# Altium project EVK-NORA-W40.PrjPcb (part 3 of 4)

## Sheet EVK-NORA-W4_SCHEM_0004_Debug_Memory.SchDoc
size A3; Date: 04/04/2024; CompanyName: U-blox; DrawnBy: ASOH; Engineer: ASOH; Organization: U-blox; SheetNumber: 5; SheetTotal: 6; SheetSize: B; SheetTitle: Interface MCU
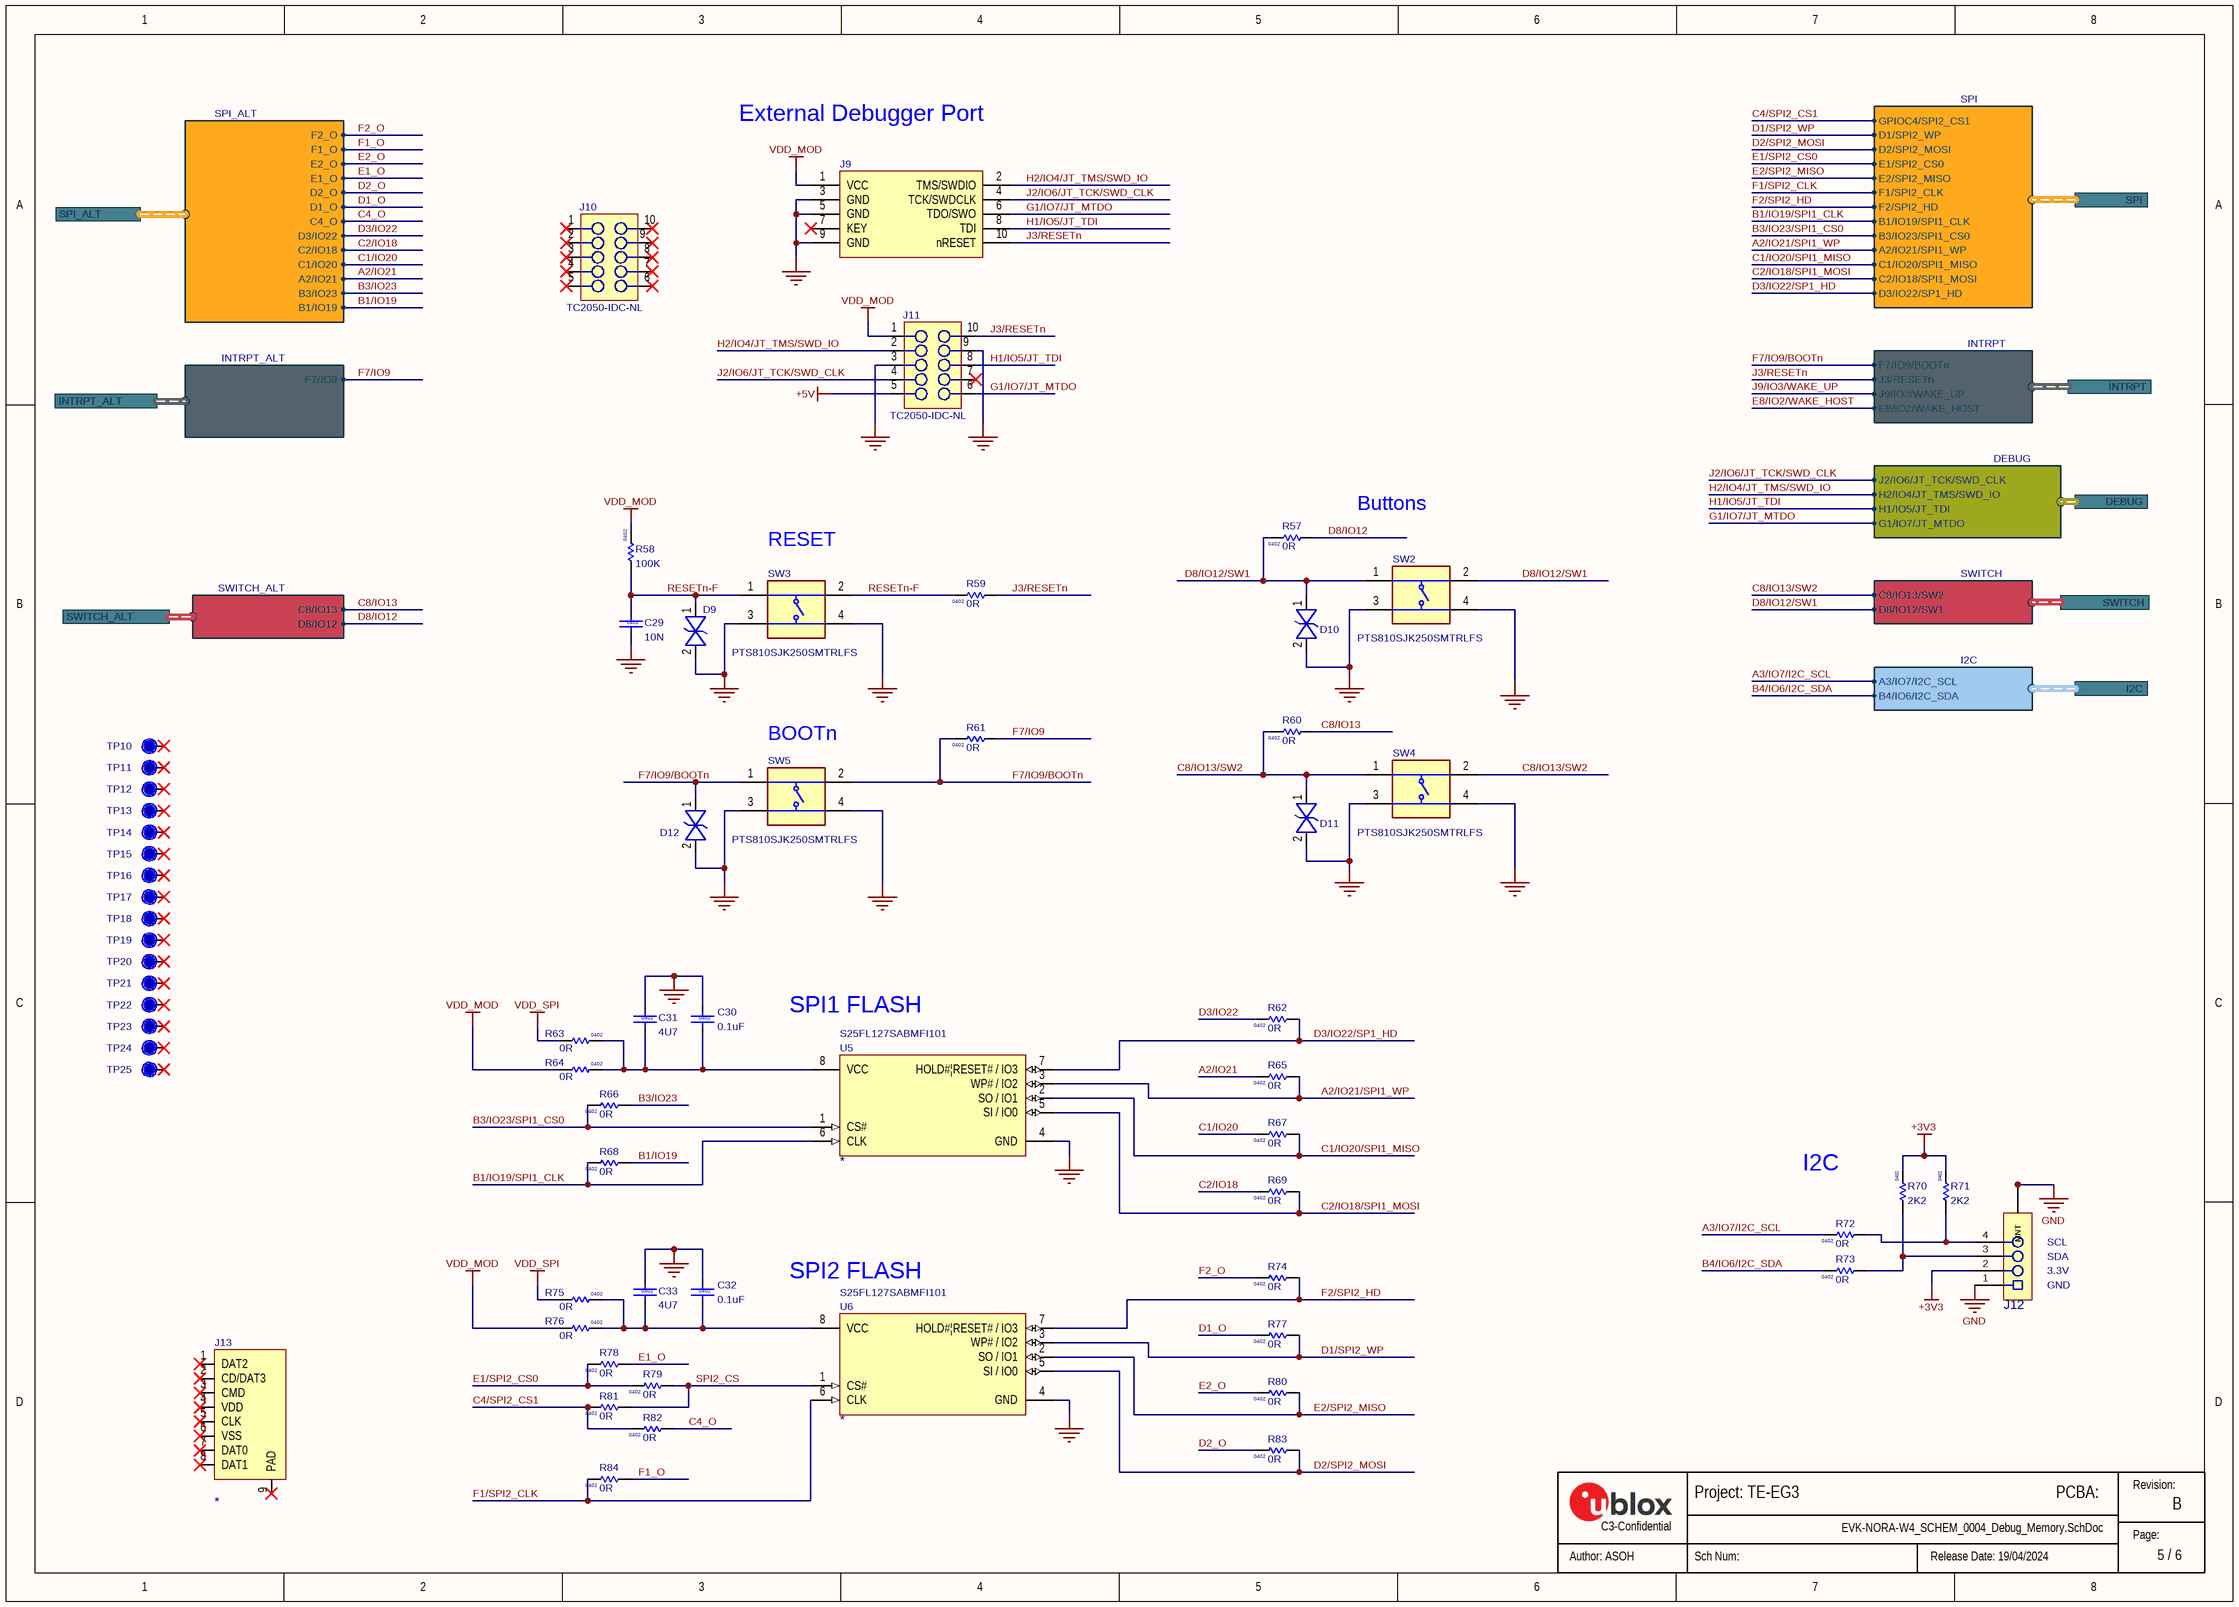
[diagram p4: EVK-NORA-W4_SCHEM_0004_Debug_Memory.SchDoc]

### Parts
C29  value 10N  Size: 0402  [Cap_0402_1100Lx600Wx600H_600x600Pad_350G_FLX]
C30  value 0.1uF  Size: 0402  [Cap 0402 HD]  (hidden comment: 120-000160.1uF)
C31  value 4U7  Size: 0402  [Cap 0402 HD]
C32  value 0.1uF  Size: 0402  [Cap 0402 HD]  (hidden comment: 120-000160.1uF)
C33  value 4U7  Size: 0402  [Cap 0402 HD]
D9  110-00019  [SOD-923]  (value not drawn)
D10  110-00019  [SOD-923]  (value not drawn)
D11  110-00019  [SOD-923]  (value not drawn)
D12  110-00019  [SOD-923]  (value not drawn)
J9  130-00099  [HDR.050P-10Pin-2x5-SMT_Key]  (value not drawn)
J10  TC2050-IDC-NLDNP  [TC2050-IDC-NL]  (value not drawn)  (no BOM)
J11  TC2050-IDC-NLDNP  [TC2050-IDC-NL]  (value not drawn)  (no BOM)
J12  UBXH04-0000797  [SM04B-SRSS-TB]  (value not drawn)
J13  (no value)  [Micro_SD_SKT_SMT_RA]
R57  value 0R  Size: 0402  [RES 0402 HD]
R58  value 100K  Size: 0402  [RES_0402_1100Lx600Wx400H_500x600Pad_400G_FLX]
R59  value 0R  Size: 0402  [RES 0402 HD]
R60  value 0R  Size: 0402  [RES 0402 HD]
R61  value 0R  Size: 0402  [RES 0402 HD]
R62  value 0R  Size: 0402  [RES 0402 HD]
R63  value 0R  Size: 0402  [RES 0402 HD]
R64  value 0R  Size: 0402  [RES 0402 HD]
R65  value 0R  Size: 0402  [RES 0402 HD]
R66  value 0R  Size: 0402  [RES 0402 HD]
R67  value 0R  Size: 0402  [RES 0402 HD]
R68  value 0R  Size: 0402  [RES 0402 HD]
R69  value 0R  Size: 0402  [RES 0402 HD]
R70  value 2K2  Size: 0402  [RES_0402_1100Lx600Wx400H_500x600Pad_400G_FLX]
R71  value 2K2  Size: 0402  [RES_0402_1100Lx600Wx400H_500x600Pad_400G_FLX]
R72  value 0R  Size: 0402  [RES 0402 HD]
R73  value 0R  Size: 0402  [RES 0402 HD]
R74  value 0R  Size: 0402  [RES 0402 HD]
R75  value 0R  Size: 0402  [RES 0402 HD]
R76  value 0R  Size: 0402  [RES 0402 HD]
R77  value 0R  Size: 0402  [RES 0402 HD]
R78  value 0R  Size: 0402  [RES 0402 HD]
R79  value 0R  Size: 0402  [RES 0402 HD]
R80  value 0R  Size: 0402  [RES 0402 HD]
R81  value 0R  Size: 0402  [RES 0402 HD]
R82  value 0R  Size: 0402  [RES 0402 HD]
R83  value 0R  Size: 0402  [RES 0402 HD]
R84  value 0R  Size: 0402  [RES 0402 HD]
SW2  PTS810SJK250SMTRLFS  [PTS810SJG250SMTRLFS]
SW3  PTS810SJK250SMTRLFS  [PTS810SJG250SMTRLFS]
SW4  PTS810SJK250SMTRLFS  [PTS810SJG250SMTRLFS]
SW5  PTS810SJK250SMTRLFS  [PTS810SJG250SMTRLFS]
TP10  TP  [TP10R]  (value not drawn)  (no BOM)
TP11  TP  [TP10R]  (value not drawn)  (no BOM)
TP12  TP  [TP10R]  (value not drawn)  (no BOM)
TP13  TP  [TP10R]  (value not drawn)  (no BOM)
TP14  TP  [TP10R]  (value not drawn)  (no BOM)
TP15  TP  [TP10R]  (value not drawn)  (no BOM)
TP16  TP  [TP10R]  (value not drawn)  (no BOM)
TP17  TP  [TP10R]  (value not drawn)  (no BOM)
TP18  TP  [TP10R]  (value not drawn)  (no BOM)
TP19  TP  [TP10R]  (value not drawn)  (no BOM)
TP20  TP  [TP10R]  (value not drawn)  (no BOM)
TP21  TP  [TP10R]  (value not drawn)  (no BOM)
TP22  TP  [TP10R]  (value not drawn)  (no BOM)
TP23  TP  [TP10R]  (value not drawn)  (no BOM)
TP24  TP  [TP10R]  (value not drawn)  (no BOM)
TP25  TP  [TP10R]  (value not drawn)  (no BOM)
U5  Manufacturer Part Number 1: S25FL127SABMFI101  [SOIC-8W]
U6  Manufacturer Part Number 1: S25FL127SABMFI101  [SOIC-8W]

### Ports
DEBUG (harness Debug), I2C (harness I2C), INTRPT (harness INTRPT), INTRPT_ALT (harness INTRPT_ALT), SPI (harness SPI), SPI_ALT (harness SPI_ALT), SWITCH (harness SWITCH), SWITCH_ALT (harness SWITCH_ALT)

### Harnesses
DEBUG: G1/IO7/JT_MTDO, H1/IO5/JT_TDI, H2/IO4/JT_TMS/SWD_IO, J2/IO6/JT_TCK/SWD_CLK
INTRPT: F7/IO9/BOOTn, J3/RESETn, J9/IO3/WAKE_UP, E8/IO2/WAKE_HOST
SPI_ALT: C4_O, D1_O, D2_O, E1_O, E2_O, F1_O, F2_O, D3/IO22, C2/IO18, C1/IO20, A2/IO21, B3/IO23, B1/IO19
SWITCH_ALT: C8/IO13, D8/IO12
INTRPT_ALT: F7/IO9
SPI: GPIOC4/SPI2_CS1, D1/SPI2_WP, D2/SPI2_MOSI, E1/SPI2_CS0, E2/SPI2_MISO, F1/SPI2_CLK, F2/SPI2_HD, B1/IO19/SPI1_CLK, B3/IO23/SPI1_CS0, A2/IO21/SPI1_WP, C1/IO20/SPI1_MISO, C2/IO18/SPI1_MOSI, D3/IO22/SP1_HD
SWITCH: C8/IO13/SW2, D8/IO12/SW1
I2C: A3/IO7/I2C_SCL, B4/IO6/I2C_SDA

### Nets
+3V3: J12.2 R70.2 R71.2
+5V: J11.5
GND: C29.2 C30.1 C31.1 C32.1 C33.1 D9.2 D10.2 D11.2 D12.2 J9.3(GND) J9.5(GND) J9.9(GND) J11.3 J12.1 J12.M1(MNT) J12.M2(MNT) SW2.3 SW2.4 SW3.3 SW3.4 SW4.3 SW4.4 SW5.3 SW5.4 U5.4(GND) U6.4(GND)
VDD_MOD: J9.1(VCC) J11.1 R58.2 R64.1 R76.1
VDD_SPI: R63.1 R75.1
A2/IO21: R65.2 ; port SPI_ALT.A2/IO21
A2/IO21/SPI1_WP: R65.1 U5.3(WP#_/_IO2) ; port SPI.A2/IO21/SPI1_WP
A3/IO7/I2C_SCL: R72.2 ; port I2C.A3/IO7/I2C_SCL
B1/IO19: R68.1 ; port SPI_ALT.B1/IO19
B1/IO19/SPI1_CLK: R68.2 U5.6(CLK) ; port SPI.B1/IO19/SPI1_CLK
B3/IO23: R66.1 ; port SPI_ALT.B3/IO23
B3/IO23/SPI1_CS0: R66.2 U5.1(CS#) ; port SPI.B3/IO23/SPI1_CS0
B4/IO6/I2C_SDA: R73.2 ; port I2C.B4/IO6/I2C_SDA
C1/IO20: R67.2 ; port SPI_ALT.C1/IO20
C1/IO20/SPI1_MISO: R67.1 U5.2(SO_/_IO1) ; port SPI.C1/IO20/SPI1_MISO
C2/IO18: R69.2 ; port SPI_ALT.C2/IO18
C2/IO18/SPI1_MOSI: R69.1 U5.5(SI_/_IO0) ; port SPI.C2/IO18/SPI1_MOSI
C4/SPI2_CS1: R81.2 R82.2 ; port SPI.GPIOC4/SPI2_CS1
C4_O: R82.1 ; port SPI_ALT.C4_O
C8/IO13: R60.1 ; port SWITCH_ALT.C8/IO13
C8/IO13/SW2: D11.1 R60.2 SW4.1 SW4.2 ; port SWITCH.C8/IO13/SW2
D1/SPI2_WP: R77.1 U6.3(WP#_/_IO2) ; port SPI.D1/SPI2_WP
D1_O: R77.2 ; port SPI_ALT.D1_O
D2/SPI2_MOSI: R83.1 U6.5(SI_/_IO0) ; port SPI.D2/SPI2_MOSI
D2_O: R83.2 ; port SPI_ALT.D2_O
D3/IO22: R62.2 ; port SPI_ALT.D3/IO22
D3/IO22/SP1_HD: R62.1 U5.7(HOLD#|RESET#_/_IO3) ; port SPI.D3/IO22/SP1_HD
D8/IO12: R57.1 ; port SWITCH_ALT.D8/IO12
D8/IO12/SW1: D10.1 R57.2 SW2.1 SW2.2 ; port SWITCH.D8/IO12/SW1
E1/SPI2_CS0: R78.2 R79.2 ; port SPI.E1/SPI2_CS0
E1_O: R78.1 ; port SPI_ALT.E1_O
E2/SPI2_MISO: R80.1 U6.2(SO_/_IO1) ; port SPI.E2/SPI2_MISO
E2_O: R80.2 ; port SPI_ALT.E2_O
F1/SPI2_CLK: R84.2 U6.6(CLK) ; port SPI.F1/SPI2_CLK
F1_O: R84.1 ; port SPI_ALT.F1_O
F2/SPI2_HD: R74.1 U6.7(HOLD#|RESET#_/_IO3) ; port SPI.F2/SPI2_HD
F2_O: R74.2 ; port SPI_ALT.F2_O
F7/IO9: R61.1 ; port INTRPT_ALT.F7/IO9
F7/IO9/BOOTn: D12.1 R61.2 SW5.1 SW5.2 ; port INTRPT.F7/IO9/BOOTn
G1/IO7/JT_MTDO: J9.6(TDO/SWO) J11.6 ; port DEBUG.G1/IO7/JT_MTDO
H1/IO5/JT_TDI: J9.8(TDI) J11.8 ; port DEBUG.H1/IO5/JT_TDI
H2/IO4/JT_TMS/SWD_IO: J9.2(TMS/SWDIO) J11.2 ; port DEBUG.H2/IO4/JT_TMS/SWD_IO
J2/IO6/JT_TCK/SWD_CLK: J9.4(TCK/SWDCLK) J11.4 ; port DEBUG.J2/IO6/JT_TCK/SWD_CLK
J3/RESETn: J9.10(nRESET) J11.10 R59.1 ; port INTRPT.J3/RESETn
RESETn-F: C29.1 D9.1 R58.1 R59.2 SW3.1 SW3.2
SPI2_CS: R79.1 R81.1 U6.1(CS#)
NetC30_2: C30.2 C31.2 R63.2 R64.2 U5.8(VCC)
NetC32_2: C32.2 C33.2 R75.2 R76.2 U6.8(VCC)
NetJ12_3: J12.3 R70.1 R73.1
NetJ12_4: J12.4 R71.1 R72.1

Not connected (* = marked no-connect by the designer): J9 7(KEY)*; J10 1* 2* 3* 4* 5* 6* 7* 8* 9 10*; J11 7* 9; J13 1(DAT2)* 2(CD/DAT3)* 3(CMD)* 4(VDD)* 5(CLK)* 6(VSS)* 7(DAT0)* 8(DAT1)* 9(PAD)*; TP10 1*; TP11 1*; TP12 1*; TP13 1*; TP14 1*; TP15 1*; TP16 1*; TP17 1*; TP18 1*; TP19 1*; TP20 1*; TP21 1*; TP22 1*; TP23 1*; TP24 1*; TP25 1*

### Notes on the sheet
- External Debugger Port
- (near SW3) RESET
- Buttons
- (near SW5) BOOTn
- (near U5) SPI1 FLASH
- I2C
- (near J12) SCL
- (near J12) SDA
- (near U6) SPI2 FLASH
- (near J12) GND
- (near J12) 3.3V
- Revision:
- C3-Confidential
- Page:

### Library data of the parts
C29 = UBXH01-0023025: CAP CER X7R 0402 10N 10% 16V; Manufacturer: Murata Manufacturing Company, Ltd.; Manufacturer P/N: GRM155R71C103KA01; Editor: roland.rust; Released by: anthony.gergis; Env: ROHS; Permitted Use: Volume Products; Perferred: PREF; Mfg P/N Status: NRND; Mfg P/N Split: 100; Mfg P/N Released: Yes; Part Number: UBXH01-0023025; Tolerance: 10%; Max Voltage: 16V; Min Operating Temp: -55°C; Max Operating Temp: 125°C; Part Type: Capacitor; Release Data: 2021-02-16T13:14:11; UBX Wiki: https://wiki.u-blox.com/bin/view/Operations/PartDetails?index=5491; RefDes: C; Manufacturer 2: Samsung Electro-Mechanics; Manufacturer P/N 2: CL05B103KO5NNNC; Mfg P/N Status 2: Active; Mfg P/N Split 2: 0; Mfg P/N Released 2: Yes; Mfg P/N Datasheet 2: https://wiki.u-blox.com/bin/view/Generic/Docs/DocumentSummary?index=28567
C30 C32 = 120-00016: Cap, Ceramic 0.1uF 10V 10% X5R 0402; Part Name: CAP CER 0.1UF 10V 10% X5R 0402; Part_Type: Ceramic Capacitor; Manufacturer: Murata Electronics North America; Manufacturer P/N: GRM155R61A104KA01J; Item_Phase: Production; Component Mounting Type: SMT; Tolerance: +/- 10%; Use in new designs: Yes; Part Number: 120-00016; Revision: 0A; Supplier 1: Digi-Key; Supplier Part Number 1: 490-6297-1-ND; Manufacturer 2: Yageo; Manufacturer P/N 2: CC0402KRX5R6BB104; Supplier 2: Digi-Key; Supplier Part Number 2: 311-1336-1-ND; Arena Link: https://app.bom.com/a/GYHPV2L2L43KRMBK?v=spec.summary; Height: 0.55mm; Pins: 2; Temperature Coefficient: X5R; Voltage: 10V
C31 C33 = UBXH01-0000243: CAP CER X5R 0402 4U7 20% 10V; Manufacturer: Murata Manufacturing Company, Ltd.; Manufacturer P/N: GRM155R61A475MEAA; Editor: martin.pilik; Released by: fabrice.bret-dibat; Env: GREEN; Permitted Use: Volume Products; Perferred: PREF; Mfg P/N Status: Active; Mfg P/N Split: 100; Mfg P/N Released: Yes; Part Number: UBXH01-0000243; Tolerance: 20%; Max Voltage: 10V; Min Operating Temp: -40°C; Max Operating Temp: 85°C; Part Type: Capacitor; Release Data: 2021-05-10 12:57:47.325652; UBX Wiki: https://wiki.u-blox.com/bin/view/Operations/PartDetails?index=24303; RefDes: C; Mfg P/N Datasheet: https://wiki.u-blox.com/bin/view/Generic/Docs/DocumentSummary?index=24302
D9-D12 = 110-00019: ESD9B3.3ST5G; Part Name: Diode TVS 3.3V SOD-923; Part_Type: Diode; Manufacturer: ON Semiconductor; Item_Phase: Preliminary; Body Size: 0.8mm x 0.6mm; Component Mounting Type: SMT; Diode Type: TVS; Use in new designs: Yes; Voltage: 3.3V; Part Number: 110-00019; Manufacturer P/N: ESD9B3.3ST5G; Supplier 1: Digi-Key; Supplier Part Number 1: ESD9B3.3ST5GOSCT-ND; Arena Link: https://app.bom.com/a/4M5DJQ9Q9SR7DV4H?v=spec.summary; Height: 0.4mm; MFG Package: SOD-923; Package Type: SOD; Pins: 2
J9 = 130-00099: Header 0.05" 10Pin 2Row SMD Black; Part Name: CON HDR 0.05" 10Pin 2Row SMD Black; Part_Type: Connector; Manufacturer: Samtec; Manufacturer P/N: FTSH-105-01-F-DV-K; Item_Phase: Pre-Production; Component Mounting Type: SMT; Keyed: Yes; Locking: No; Pin Pitch: 0.050"; Rows: 2; Part Number: 130-00099; Revision: 1; Supplier 1: Digi-Key; Supplier Part Number 1: SAM8796-ND; Arena Link: https://app.bom.com/a/5N6EKRARATS7TSHL?v=spec.summary; Color: Black; Connector Type: Header; Height: 6mm; Length: 12.75mm; Pins: 10; Use in new designs: Yes; Width: 4.78
J10 J11 = TC2050-IDC-NL: CON PADS FOR CBL PLUG-OF-NAILS 10-PIN NO LEGS; Manufacturer: TAG Connect; Added By: Paul B; Manufacturer P/N: TC2050-IDC-NL; Part Number: TC2050-IDC-NL; Size: 6.1mm x 9.9mm; Height: 0; DNP: DNP; Added Date: 12/3/2015
J12 = UBXH04-0000797: CONN JST SH SERIES SMT 4 POS MALE 1MM RA 50V 1A; Manufacturer 1: JST Sales America Inc.; Manufacturer Part Number 1: SM04B-SRSS-TB(LF)(SN); Part Name: CONN HEADER SMD R/A 4POS 1MM; Item Phase: In Production; Use in new designs: Yes; Voltage: None; Value: SM04B-SRSS-TB; Editor: eric.moog; Env: ROHS; Permitted Use: Support Products; Perferred: PREF; Mfg P/N Status: Active; Mfg P/N Split: 100; Mfg P/N Released: No; Part Number: UBXH04-0000797; Supplier 1: None; Supplier Part Number 1: None; Diameter: None; Height: 2.9mm; Max Operating Temp: 85°C; Min Operating Temp: -30°C; Pins: 4; Revision: 0A; UBX Code: None; Manufacturer 2: None; Manufacturer Part Number 2: None; Supplier 2: None; Supplier Part Number 2: None; Manufacturer P/N: SM04B-SRSS-TB; Max Voltage: 50V; Max Current: 1A; Part Type: Connector; UBX Wiki: https://wiki.u-blox.com/bin/view/Operations/PartDetails?index=38779; RefDes: J; Manufacturer: JST; Mfg P/N Datasheet: https://wiki.u-blox.com/bin/view/Generic/Docs/DocumentSummary?index=4533
J13 = 130-00062: Micro SD Card Socket, Right Angle, with 4 Ground Pads, SMT; Manufacturer 1: Molex Inc; Manufacturer Part Number 1: 0472192001; Part Name: CON Micro SD 1.1mm 8Pin 1Row SMT RA; Item Phase: In Production; Use in new designs: Yes; Voltage: None; Manufacturer P/N: *; Part Number: 130-00062; Supplier 1: Digi-Key; Supplier Part Number 1: WM6698CT-ND; Diameter: None; Height: 1.9mm; Max Operating Temp: None; Min Operating Temp: None; Pins: 8; Revision: 0A; UBX Code: None; Manufacturer 2: None; Manufacturer Part Number 2: None; Supplier 2: None; Supplier Part Number 2: None
R57 R59-R62 R65-R69 R72-R74 R77-R84 = UBXH18-0003002: RES THICK FILM CHIP 0402 0R 0 100mW; Manufacturer: KOA; Manufacturer P/N: RK73Z1ETTP; Tolerance: 0; Editor: charlotte.biber; Released by: peter.mueller; Env: ROHS; Permitted Use: Volume Products; Perferred: PREF; Mfg P/N Status: NRND; Mfg P/N Split: 100; Mfg P/N Released: Yes; Part Number: UBXH18-0003002; Max Power: 100mW; Part Type: Resistor; Release Data: 2012-06-05 09:49:55.978616; UBX Wiki: https://wiki.u-blox.com/bin/view/Operations/PartDetails?index=6611; RefDes: R; Manufacturer 2: YAGEO; Manufacturer P/N 2: 2322_705_91001_L; Mfg P/N Status 2: NRND; Mfg P/N Split 2: 0; Mfg P/N Released 2: Yes
R58 = UBXH18-0008097: RES THICK FILM CHIP 0402 100K 5% 100mW; Manufacturer: YAGEO; Manufacturer P/N: 2322_705_70104_L; Editor: roland.rust; Env: ROHS; Permitted Use: Volume Products; Perferred: PREF; Mfg P/N Status: Obsolete; Mfg P/N Split: 100; Mfg P/N Released: Yes; Part Number: UBXH18-0008097; Tolerance: 5%; Max Power: 100mW; Part Type: Resistor; Released by: roland.rust; Release Data: 2005-07-22T13:59:44; UBX Wiki: https://wiki.u-blox.com/bin/view/Operations/PartDetails?index=7020; RefDes: R; Manufacturer 2: KOA; Manufacturer P/N 2: RK73B1ETTD104J; Mfg P/N Status 2: NRND; Mfg P/N Split 2: 0; Mfg P/N Released 2: Yes
R63 R64 R75 R76 = UBXH18-0003002: RES THICK FILM CHIP 0402 0R 0 100mW; Manufacturer: KOA; Manufacturer P/N: RK73Z1ETTD; Tolerance: 0; Editor: charlotte.biber; Released by: peter.mueller; Env: ROHS; Permitted Use: Volume Products; Perferred: PREF; Mfg P/N Status: NRND; Mfg P/N Split: 100; Mfg P/N Released: Yes; Part Number: UBXH18-0003002; Max Power: 100mW; Part Type: Resistor; Release Data: 2012-06-05 09:49:55.978616; UBX Wiki: https://wiki.u-blox.com/bin/view/Operations/PartDetails?index=6611; RefDes: R; Manufacturer 2: YAGEO; Manufacturer P/N 2: 2322_705_91001_L; Mfg P/N Status 2: NRND; Mfg P/N Split 2: 0; Mfg P/N Released 2: Yes
R70 R71 = UBXH18-0008057: RES THICK FILM CHIP 0402 2K2 5% 100mW; Manufacturer: YAGEO; Manufacturer P/N: 2322_705_87222_L; Editor: roland.rust; Env: ROHS; Permitted Use: Volume Products; Perferred: PREF; Mfg P/N Status: Obsolete; Mfg P/N Split: 100; Mfg P/N Released: Yes; Part Number: UBXH18-0008057; Tolerance: 5%; Max Power: 100mW; Part Type: Resistor; Released by: roland.rust; Release Data: 2007-02-09T10:46:57; UBX Wiki: https://wiki.u-blox.com/bin/view/Operations/PartDetails?index=6956; RefDes: R; Manufacturer 2: YAGEO; Manufacturer P/N 2: RC0402JR-072K2L; Mfg P/N Status 2: Active; Mfg P/N Split 2: 0; Mfg P/N Released 2: Yes; Mfg P/N Datasheet 2: https://wiki.u-blox.com/bin/view/Generic/Docs/DocumentSummary?index=8163
SW2-SW5 = PTS810SJK250SMTRLFS: Switch; Manufacturer_Name: C & K COMPONENTS; Datasheet Link: https://www.ckswitches.com/media/1476/pts810.pdf; Manufacturer_Part_Number: PTS810SJK250SMTRLFS; Mouser Part Number: 611-PTS810SJK250SMTR; Mouser Price/Stock: https://www.mouser.co.uk/ProductDetail/CK/PTS810SJK250SMTRLFS?qs=UxeAxwACbqlfHzoZSrW3%2Fw%3D%3D
TP10-TP25 = TP10R: Testpoint, Round 1.0mm Dia; Added By: Jeremy D; Part Number: TP10R; Size: 1.0mm; Height: 0; DNP: DNP; Added Date: 2/1/2015; Checked By: Paul B; Checked Date: 2/5/2015
U5 U6 = 240-00017: IC, Flash 128MBIT, 108MHz, 8SOIC; Manufacturer 1: Cypress Semiconductor Corp; Part Name: IC Flash 128MBIT 108MHz 8SOIC; Body Size: 5.28mm x 5.28mm; Interface: SPI; Item Phase: Unreleased; Memory Type: Flash - NOR; MFG Package: 8-SOIC; SMT Pitch: 1.27mm; Thermal Pad: No; Use in new designs: Yes; Voltage: 3.6V; UBX Code: None; Manufacturer P/N: *; Part Number: 240-00017; Supplier 1: Digi-Key; Supplier Part Number 1: 1274-1045-ND; Height: 2.16mm; Memory Size: 128Mbit; Memory Speed: 108MHz; Max Operating Temp: 85; Min Operating Temp: -40; Pins: 8; Revision: None; Manufacturer 2: None; Manufacturer Part Number 2: None; Supplier 2: None; Supplier Part Number 2: None

## Sheet EVK-NORA-W4_SCHEM_0005_MikroE_ULED.SchDoc
size A3; Date: 04/04/2024; SheetNumber: 6; SheetTotal: 6
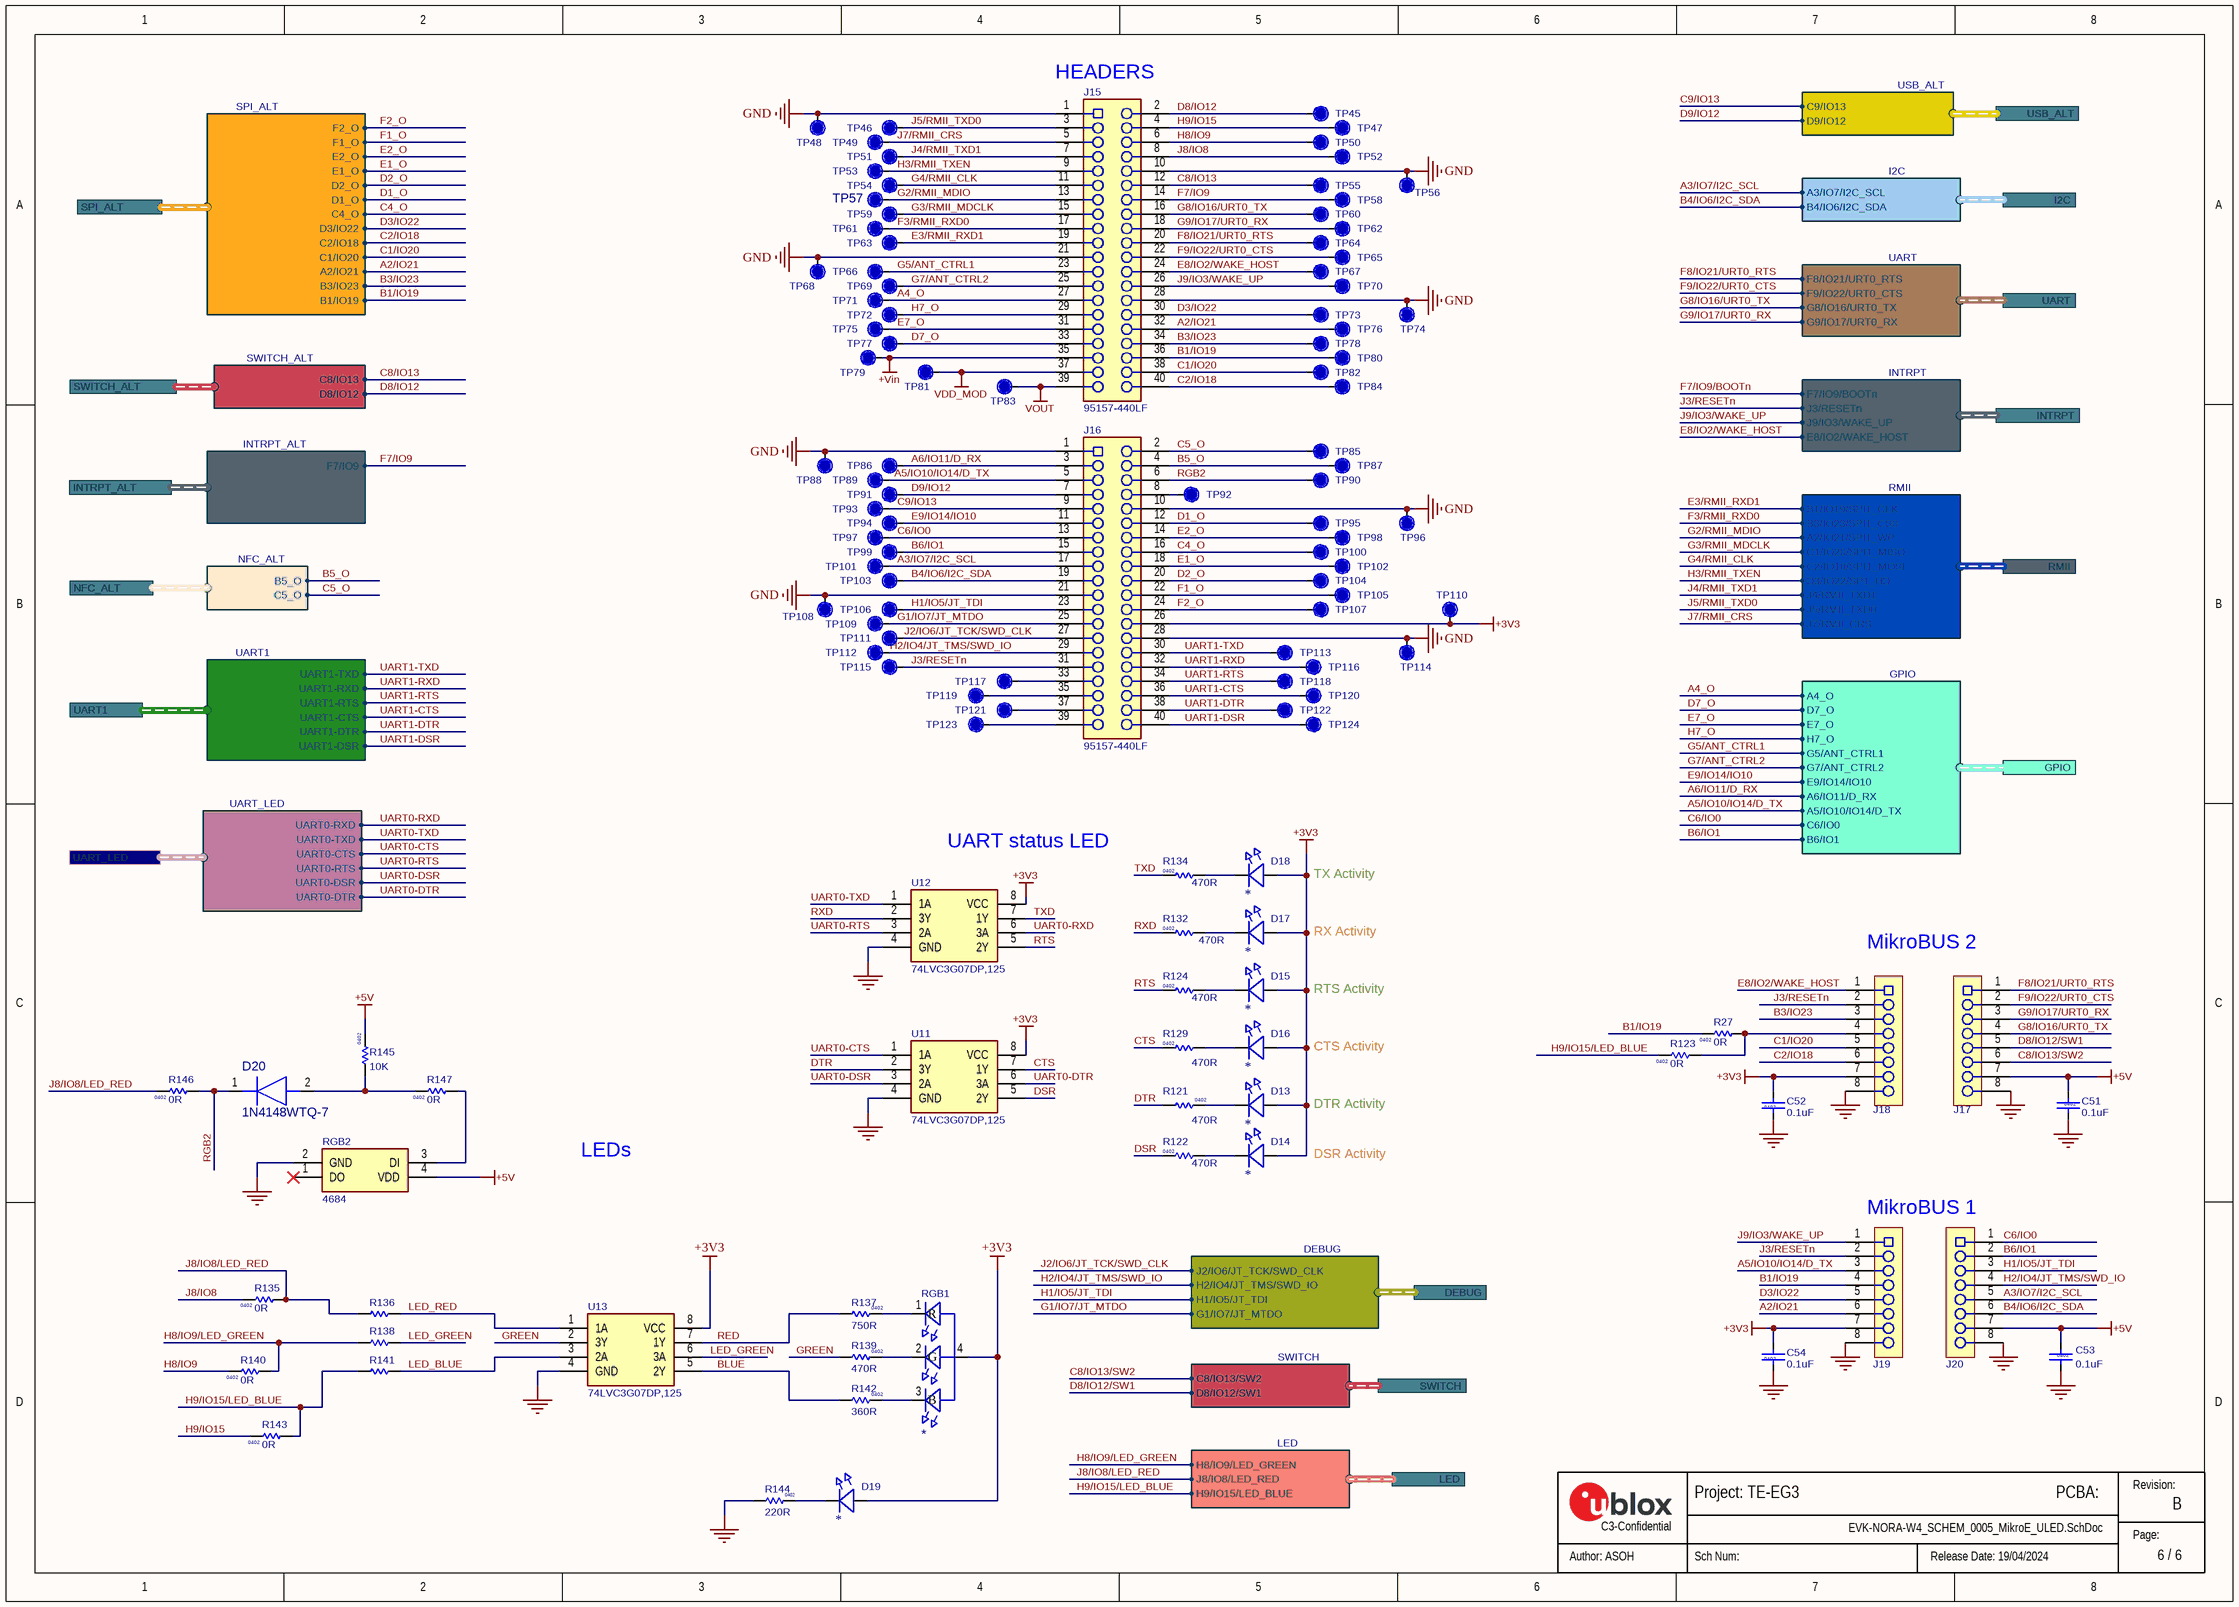
[diagram p5: EVK-NORA-W4_SCHEM_0005_MikroE_ULED.SchDoc]

### Parts
C51  value 0.1uF  Size: 0402  [Cap 0402 HD]  (hidden comment: 120-000160.1uF)
C52  value 0.1uF  Size: 0402  [Cap 0402 HD]  (hidden comment: 120-000160.1uF)
C53  value 0.1uF  Size: 0402  [Cap 0402 HD]  (hidden comment: 120-000160.1uF)
C54  value 0.1uF  Size: 0402  [Cap 0402 HD]  (hidden comment: 120-000160.1uF)
D13  (no value)  [LED_0603_GREEN]
D14  (no value)  [LED_0603_YELLOW]
D15  (no value)  [LED_0603_GREEN]
D16  (no value)  [LED_0603_YELLOW]
D17  (no value)  [LED_0603_YELLOW]
D18  (no value)  [LED_0603_GREEN]
D19  (no value)  [LED_0603_GREEN]
D20  1N4148WTQ-7  [SODFL1608X65N]
J15  95157-440LF  [M208762042]
J16  95157-440LF  [M208762042]
J17  (no value)  [SKT-0.1P-SSM-108-L-SV]
J18  (no value)  [SKT-0.1P-SSM-108-L-SV]
J19  (no value)  [SKT-0.1P-SSM-108-L-SV]
J20  (no value)  [SKT-0.1P-SSM-108-L-SV]
R27  value 0R  Size: 0402  [RES 0402 HD]
R121  value 470R  Size: 0402  [RES_0402_1100Lx600Wx400H_500x600Pad_400G_FLX]
R122  value 470R  Size: 0402  [RES_0402_1100Lx600Wx400H_500x600Pad_400G_FLX]
R123  value 0R  Size: 0402  [RES 0402 HD]
R124  value 470R  Size: 0402  [RES_0402_1100Lx600Wx400H_500x600Pad_400G_FLX]
R129  value 470R  Size: 0402  [RES_0402_1100Lx600Wx400H_500x600Pad_400G_FLX]
R132  value 470R  Size: 0402  [RES_0402_1100Lx600Wx400H_500x600Pad_400G_FLX]
R134  value 470R  Size: 0402  [RES_0402_1100Lx600Wx400H_500x600Pad_400G_FLX]
R135  value 0R  Size: 0402  [RES 0402 HD]
R136  (no value)  [RES 0402 HD]
R137  value 750R  Size: 0402  [RES_0402_1100Lx600Wx400H_500x600Pad_400G_FLX]
R138  (no value)  [RES 0402 HD]
R139  value 470R  Size: 0402  [RES_0402_1100Lx600Wx400H_500x600Pad_400G_FLX]
R140  value 0R  Size: 0402  [RES 0402 HD]
R141  (no value)  [RES 0402 HD]
R142  value 360R  Size: 0402  [RES_0402_1100Lx600Wx400H_500x600Pad_400G_FLX]
R143  value 0R  Size: 0402  [RES 0402 HD]
R144  value 220R  Size: 0402  [RES 0402 HD]
R145  value 10K  Size: 0402  [RES 0402 HD]
R146  value 0R  Size: 0402  [RES 0402 HD]
R147  value 0R  Size: 0402  [RES 0402 HD]
RGB1  (no value)  [LED_1616]
RGB2  4684  [4684]
TP45  TP  [TP10R]  (value not drawn)  (no BOM)
TP46  TP  [TP10R]  (value not drawn)  (no BOM)
TP47  TP  [TP10R]  (value not drawn)  (no BOM)
TP48  TP  [TP10R]  (value not drawn)  (no BOM)
TP49  TP  [TP10R]  (value not drawn)  (no BOM)
TP50  TP  [TP10R]  (value not drawn)  (no BOM)
TP51  TP  [TP10R]  (value not drawn)  (no BOM)
TP52  TP  [TP10R]  (value not drawn)  (no BOM)
TP53  TP  [TP10R]  (value not drawn)  (no BOM)
TP54  TP  [TP10R]  (value not drawn)  (no BOM)
TP55  TP  [TP10R]  (value not drawn)  (no BOM)
TP56  TP  [TP10R]  (value not drawn)  (no BOM)
TP57  TP  [TP10R]  (value not drawn)
TP58  TP  [TP10R]  (value not drawn)  (no BOM)
TP59  TP  [TP10R]  (value not drawn)  (no BOM)
TP60  TP  [TP10R]  (value not drawn)  (no BOM)
TP61  TP  [TP10R]  (value not drawn)  (no BOM)
TP62  TP  [TP10R]  (value not drawn)  (no BOM)
TP63  TP  [TP10R]  (value not drawn)  (no BOM)
TP64  TP  [TP10R]  (value not drawn)  (no BOM)
TP65  TP  [TP10R]  (value not drawn)  (no BOM)
TP66  TP  [TP10R]  (value not drawn)  (no BOM)
TP67  TP  [TP10R]  (value not drawn)  (no BOM)
TP68  TP  [TP10R]  (value not drawn)  (no BOM)
TP69  TP  [TP10R]  (value not drawn)  (no BOM)
TP70  TP  [TP10R]  (value not drawn)  (no BOM)
TP71  TP  [TP10R]  (value not drawn)  (no BOM)
TP72  TP  [TP10R]  (value not drawn)  (no BOM)
TP73  TP  [TP10R]  (value not drawn)  (no BOM)
TP74  TP  [TP10R]  (value not drawn)  (no BOM)
TP75  TP  [TP10R]  (value not drawn)  (no BOM)
TP76  TP  [TP10R]  (value not drawn)  (no BOM)
TP77  TP  [TP10R]  (value not drawn)  (no BOM)
TP78  TP  [TP10R]  (value not drawn)  (no BOM)
TP79  TP  [TP10R]  (value not drawn)  (no BOM)
TP80  TP  [TP10R]  (value not drawn)  (no BOM)
TP81  TP  [TP10R]  (value not drawn)  (no BOM)
TP82  TP  [TP10R]  (value not drawn)  (no BOM)
TP83  TP  [TP10R]  (value not drawn)  (no BOM)
TP84  TP  [TP10R]  (value not drawn)  (no BOM)
TP85  TP  [TP10R]  (value not drawn)  (no BOM)
TP86  TP  [TP10R]  (value not drawn)  (no BOM)
TP87  TP  [TP10R]  (value not drawn)  (no BOM)
TP88  TP  [TP10R]  (value not drawn)  (no BOM)
TP89  TP  [TP10R]  (value not drawn)  (no BOM)
TP90  TP  [TP10R]  (value not drawn)  (no BOM)
TP91  TP  [TP10R]  (value not drawn)  (no BOM)
TP92  TP  [TP10R]  (value not drawn)  (no BOM)
TP93  TP  [TP10R]  (value not drawn)  (no BOM)
TP94  TP  [TP10R]  (value not drawn)  (no BOM)
TP95  TP  [TP10R]  (value not drawn)  (no BOM)
TP96  TP  [TP10R]  (value not drawn)  (no BOM)
TP97  TP  [TP10R]  (value not drawn)  (no BOM)
TP98  TP  [TP10R]  (value not drawn)  (no BOM)
TP99  TP  [TP10R]  (value not drawn)  (no BOM)
TP100  TP  [TP10R]  (value not drawn)  (no BOM)
TP101  TP  [TP10R]  (value not drawn)  (no BOM)
TP102  TP  [TP10R]  (value not drawn)  (no BOM)
TP103  TP  [TP10R]  (value not drawn)  (no BOM)
TP104  TP  [TP10R]  (value not drawn)  (no BOM)
TP105  TP  [TP10R]  (value not drawn)  (no BOM)
TP106  TP  [TP10R]  (value not drawn)  (no BOM)
TP107  TP  [TP10R]  (value not drawn)  (no BOM)
TP108  TP  [TP10R]  (value not drawn)  (no BOM)
TP109  TP  [TP10R]  (value not drawn)  (no BOM)
TP110  TP  [TP10R]  (value not drawn)  (no BOM)
TP111  TP  [TP10R]  (value not drawn)  (no BOM)
TP112  TP  [TP10R]  (value not drawn)  (no BOM)
TP113  TP  [TP10R]  (value not drawn)  (no BOM)
TP114  TP  [TP10R]  (value not drawn)  (no BOM)
TP115  TP  [TP10R]  (value not drawn)  (no BOM)
TP116  TP  [TP10R]  (value not drawn)  (no BOM)
TP117  TP  [TP10R]  (value not drawn)  (no BOM)
TP118  TP  [TP10R]  (value not drawn)  (no BOM)
TP119  TP  [TP10R]  (value not drawn)  (no BOM)
TP120  TP  [TP10R]  (value not drawn)  (no BOM)
TP121  TP  [TP10R]  (value not drawn)  (no BOM)
TP122  TP  [TP10R]  (value not drawn)  (no BOM)
TP123  TP  [TP10R]  (value not drawn)  (no BOM)
TP124  TP  [TP10R]  (value not drawn)  (no BOM)
U11  74LVC3G07DP,125  [SOP65P400X110-8N]
U12  74LVC3G07DP,125  [SOP65P400X110-8N]
U13  74LVC3G07DP,125  [SOP65P400X110-8N]

### Ports
DEBUG (harness Debug), GPIO (harness GPIO), I2C (harness I2C), INTRPT (harness INTRPT), INTRPT_ALT (harness INTRPT_ALT), LED (harness LED), NFC_ALT (harness NFC_ALT), RMII (harness RMII), SPI_ALT (harness SPI_ALT), SWITCH (harness SWITCH), SWITCH_ALT (harness SWITCH_ALT), UART1 (harness UART1), UART (harness UART), UART_LED (harness UART_LED), USB_ALT (harness USB_ALT)

### Harnesses
INTRPT: F7/IO9/BOOTn, J3/RESETn, J9/IO3/WAKE_UP, E8/IO2/WAKE_HOST
UART: F8/IO21/URT0_RTS, F9/IO22/URT0_CTS, G8/IO16/URT0_TX, G9/IO17/URT0_RX
RMII: B1/IO19/SPI1_CLK, B3/IO23/SPI1_CS0, A2/IO21/SPI1_WP, C1/IO20/SPI1_MISO, C2/IO18/SPI1_MOSI, D3/IO22/SP1_HD, J4/RMII_TXD1, J5/RMII_TXD0, J7/RMII_CRS
INTRPT_ALT: F7/IO9
USB_ALT: D9/IO12, C9/IO13
SWITCH_ALT: C8/IO13, D8/IO12
I2C: A3/IO7/I2C_SCL, B4/IO6/I2C_SDA
UART1: UART1-TXD, UART1-RXD, UART1-RTS, UART1-CTS, UART1-DTR, UART1-DSR
GPIO: E7_O, D7_O, A4_O, H7_O, G5/ANT_CTRL1, G7/ANT_CTRL2, E9/IO14/IO10, A6/IO11/D_RX, A5/IO10/IO14/D_TX, C6/IO0, B6/IO1
SPI_ALT: C4_O, D1_O, D2_O, E1_O, E2_O, F1_O, F2_O, D3/IO22, C2/IO18, C1/IO20, A2/IO21, B3/IO23, B1/IO19
LED: H9/IO15/LED_BLUE, J8/IO8/LED_RED, H8/IO9/LED_GREEN
NFC_ALT: B5_O, C5_O
DEBUG: G1/IO7/JT_MTDO, H1/IO5/JT_TDI, H2/IO4/JT_TMS/SWD_IO, J2/IO6/JT_TCK/SWD_CLK
SWITCH: C8/IO13/SW2, D8/IO12/SW1
UART_LED: UART0-TXD, UART0-CTS, UART0-RTS, UART0-DSR, UART0-DTR, UART0-RXD

### Nets
+3V3: C52.2 C54.2 D13.2(A) D14.2(A) D15.2(A) D16.2(A) D17.2(A) D18.2(A) D19.2(A) J16.26 J18.7 J19.7 RGB1.4(A) TP110.1 U11.8(VCC) U12.8(VCC) U13.8(VCC)
+5V: C51.1 C53.1 J17.7 J20.7 R145.2 RGB2.4(VDD)
+Vin: J15.35 TP79.1
GND: C51.2 C52.1 C53.2 C54.1 J15.1 J15.10 J15.21 J15.28 J16.1 J16.10 J16.21 J16.28 J17.8 J18.8 J19.8 J20.8 R144.1 RGB2.2(GND) TP48.1 TP56.1 TP68.1 TP74.1 TP88.1 TP96.1 TP108.1 TP114.1 U11.4(GND) U12.4(GND) U13.4(GND)
VDD_MOD: J15.37 TP81.1
VOUT: J15.39 TP83.1
A2/IO21: J15.32 J19.6 TP76.1 ; port SPI_ALT.A2/IO21
A3/IO7/I2C_SCL: J16.17 J20.5 TP101.1 ; port I2C.A3/IO7/I2C_SCL
A4_O: J15.27 TP71.1 ; port GPIO.A4_O
A5/IO10/IO14/D_TX: J16.5 J19.3 TP89.1 ; port GPIO.A5/IO10/IO14/D_TX
A6/IO11/D_RX: J16.3 TP86.1 ; port GPIO.A6/IO11/D_RX
B1/IO19: J15.36 J19.4 R27.2 TP80.1 ; port SPI_ALT.B1/IO19
B3/IO23: J15.34 J18.3 TP78.1 ; port SPI_ALT.B3/IO23
B4/IO6/I2C_SDA: J16.19 J20.6 TP103.1 ; port I2C.B4/IO6/I2C_SDA
B5_O: J16.4 TP87.1 ; port NFC_ALT.B5_O
B6/IO1: J16.15 J20.2 TP99.1 ; port GPIO.B6/IO1
BLUE: R142.1 U13.5(2Y)
C1/IO20: J15.38 J18.5 TP82.1 ; port SPI_ALT.C1/IO20
C2/IO18: J15.40 J18.6 TP84.1 ; port SPI_ALT.C2/IO18
C4_O: J16.16 TP100.1 ; port SPI_ALT.C4_O
C5_O: J16.2 TP85.1 ; port NFC_ALT.C5_O
C6/IO0: J16.13 J20.1 TP97.1 ; port GPIO.C6/IO0
C8/IO13: J15.12 TP55.1 ; port SWITCH_ALT.C8/IO13
C8/IO13/SW2: J17.6 ; port SWITCH.C8/IO13/SW2
C9/IO13: J16.9 TP93.1 ; port USB_ALT.C9/IO13
CTS: R129.1 U11.7(1Y)
D1_O: J16.12 TP95.1 ; port SPI_ALT.D1_O
D2_O: J16.20 TP104.1 ; port SPI_ALT.D2_O
D3/IO22: J15.30 J19.5 TP73.1 ; port SPI_ALT.D3/IO22
D7_O: J15.33 TP77.1 ; port GPIO.D7_O
D8/IO12: J15.2 TP45.1 ; port SWITCH_ALT.D8/IO12
D8/IO12/SW1: J17.5 ; port SWITCH.D8/IO12/SW1
D9/IO12: J16.7 TP91.1 ; port USB_ALT.D9/IO12
DSR: R122.1 U11.5(2Y)
DTR: R121.1 U11.2(3Y)
E1_O: J16.18 TP102.1 ; port SPI_ALT.E1_O
E2_O: J16.14 TP98.1 ; port SPI_ALT.E2_O
E3/RMII_RXD1: J15.19 TP63.1 ; port RMII.B1/IO19/SPI1_CLK
E7_O: J15.31 TP75.1 ; port GPIO.E7_O
E8/IO2/WAKE_HOST: J15.24 J18.1 TP67.1 ; port INTRPT.E8/IO2/WAKE_HOST
E9/IO14/IO10: J16.11 TP94.1 ; port GPIO.E9/IO14/IO10
F1_O: J16.22 TP105.1 ; port SPI_ALT.F1_O
F2_O: J16.24 TP107.1 ; port SPI_ALT.F2_O
F3/RMII_RXD0: J15.17 TP61.1 ; port RMII.B3/IO23/SPI1_CS0
F7/IO9: J15.14 TP58.1 ; port INTRPT_ALT.F7/IO9
F8/IO21/URT0_RTS: J15.20 J17.1 TP64.1 ; port UART.F8/IO21/URT0_RTS
F9/IO22/URT0_CTS: J15.22 J17.2 TP65.1 ; port UART.F9/IO22/URT0_CTS
G1/IO7/JT_MTDO: J16.25 TP109.1 ; port DEBUG.G1/IO7/JT_MTDO
G2/RMII_MDIO: J15.13 TP57.1 ; port RMII.A2/IO21/SPI1_WP
G3/RMII_MDCLK: J15.15 TP59.1 ; port RMII.C1/IO20/SPI1_MISO
G4/RMII_CLK: J15.11 TP54.1 ; port RMII.C2/IO18/SPI1_MOSI
G5/ANT_CTRL1: J15.23 TP66.1 ; port GPIO.G5/ANT_CTRL1
G7/ANT_CTRL2: J15.25 TP69.1 ; port GPIO.G7/ANT_CTRL2
G8/IO16/URT0_TX: J15.16 J17.4 TP60.1 ; port UART.G8/IO16/URT0_TX
G9/IO17/URT0_RX: J15.18 J17.3 TP62.1 ; port UART.G9/IO17/URT0_RX
GREEN: R139.1 U13.2(3Y)
H1/IO5/JT_TDI: J16.23 J20.3 TP106.1 ; port DEBUG.H1/IO5/JT_TDI
H2/IO4/JT_TMS/SWD_IO: J16.29 J20.4 TP112.1 ; port DEBUG.H2/IO4/JT_TMS/SWD_IO
H3/RMII_TXEN: J15.9 TP53.1 ; port RMII.D3/IO22/SP1_HD
H7_O: J15.29 TP72.1 ; port GPIO.H7_O
H8/IO9: J15.6 R140.2 TP50.1
H8/IO9/LED_GREEN: R138.2 R140.1 ; port LED.H8/IO9/LED_GREEN
H9/IO15: J15.4 R143.2 TP47.1
H9/IO15/LED_BLUE: R123.2 R141.2 R143.1 ; port LED.H9/IO15/LED_BLUE
J2/IO6/JT_TCK/SWD_CLK: J16.27 TP111.1 ; port DEBUG.J2/IO6/JT_TCK/SWD_CLK
J3/RESETn: J16.31 J18.2 J19.2 TP115.1 ; port INTRPT.J3/RESETn
J4/RMII_TXD1: J15.7 TP51.1 ; port RMII.J4/RMII_TXD1
J5/RMII_TXD0: J15.3 TP46.1 ; port RMII.J5/RMII_TXD0
J7/RMII_CRS: J15.5 TP49.1 ; port RMII.J7/RMII_CRS
J8/IO8: J15.8 R135.2 TP52.1
J8/IO8/LED_RED: R135.1 R136.2 R146.2 ; port LED.J8/IO8/LED_RED
J9/IO3/WAKE_UP: J15.26 J19.1 TP70.1 ; port INTRPT.J9/IO3/WAKE_UP
LED_BLUE: R141.1 U13.3(2A)
LED_GREEN: R138.1 U13.6(3A)
LED_RED: R136.1 U13.1(1A)
RED: R137.1 U13.7(1Y)
RGB2: D20.1(K) J16.6 R146.1 TP90.1
RTS: R124.1 U12.5(2Y)
RXD: R132.1 U12.2(3Y)
TXD: R134.1 U12.7(1Y)
UART0-CTS: U11.1(1A) ; port UART_LED.UART0-CTS
UART0-DSR: U11.3(2A) ; port UART_LED.UART0-DSR
UART0-DTR: U11.6(3A) ; port UART_LED.UART0-DTR
UART0-RTS: U12.3(2A) ; port UART_LED.UART0-RTS
UART0-RXD: U12.6(3A) ; port UART_LED.UART0-RXD
UART0-TXD: U12.1(1A) ; port UART_LED.UART0-TXD
UART1-CTS: J16.36 TP120.1 ; port UART1.UART1-CTS
UART1-DSR: J16.40 TP124.1 ; port UART1.UART1-DSR
UART1-DTR: J16.38 TP122.1 ; port UART1.UART1-DTR
UART1-RTS: J16.34 TP118.1 ; port UART1.UART1-RTS
UART1-RXD: J16.32 TP116.1 ; port UART1.UART1-RXD
UART1-TXD: J16.30 TP113.1 ; port UART1.UART1-TXD
NetD13_1: D13.1(C) R121.2
NetD14_1: D14.1(C) R122.2
NetD15_1: D15.1(C) R124.2
NetD16_1: D16.1(C) R129.2
NetD17_1: D17.1(C) R132.2
NetD18_1: D18.1(C) R134.2
NetD19_1: D19.1(C) R144.2
NetD20_2: D20.2(A) R145.1 R147.2
NetJ16_8: J16.8 TP92.1
NetJ16_33: J16.33 TP117.1
NetJ16_35: J16.35 TP119.1
NetJ16_37: J16.37 TP121.1
NetJ16_39: J16.39 TP123.1
NetJ18_4: J18.4 R27.1 R123.1
NetR137_2: R137.2 RGB1.1(R)
NetR139_2: R139.2 RGB1.2(G)
NetR142_2: R142.2 RGB1.3(B)
NetR147_1: R147.1 RGB2.3(DI)

Not connected (* = marked no-connect by the designer): RGB2 1(DO)*

### Notes on the sheet
- (near J15) HEADERS
- UART status LED
- TX Activity
- RX Activity
- MikroBUS 2
- CTS Activity
- RTS Activity
- DTR Activity
- LEDs
- DSR Activity
- MikroBUS 1
- Revision:
- C3-Confidential
- Page:

### Library data of the parts
C51-C54 = 120-00016: as C30 on sheet EVK-NORA-W4_SCHEM_0004_Debug_Memory; Part Number: 120-00016; Revision: 0A; Supplier 1: Digi-Key; Supplier Part Number 1: 490-6297-1-ND; Manufacturer 2: Yageo; Manufacturer P/N 2: CC0402KRX5R6BB104; Supplier 2: Digi-Key; Supplier Part Number 2: 311-1336-1-ND; Arena Link: https://app.bom.com/a/GYHPV2L2L43KRMBK?v=spec.summary; Height: 0.55mm; Pins: 2; Temperature Coefficient: X5R; Voltage: 10V
D13 D15 D18 D19 = UBXH11-0000001: LED SMD 0603 GREEN 2.5V 20mA; Manufacturer: Kingbright; Manufacturer P/N: APT1608SGC; Editor: gianni.falleroni; Released by: alex.claville; Env: ROHS; Permitted Use: Support Products; Mfg P/N Status: Active; Mfg P/N Split: 50; Mfg P/N Released: Yes; Color: *; Part Number: UBXH11-0000001; Value: GREEN; Max Voltage: 2.5V; Max Current: 20mA; Size: 0603; Part Type: LED; Release Data: 2022-09-27T14:26:54; UBX Wiki: https://wiki.u-blox.com/bin/view/Operations/PartDetails?index=7902; Perferred: N/A; RefDes: DS; Mfg P/N Datasheet: https://wiki.u-blox.com/bin/view/Generic/Docs/DocumentSummary?index=37527; Manufacturer 2: Lite-on Technology Corporation; Manufacturer P/N 2: LTST-C190KGKT; Mfg P/N Status 2: Active; Mfg P/N Split 2: 50; Mfg P/N Released 2: Yes; Mfg P/N Datasheet 2: https://wiki.u-blox.com/bin/view/Generic/Docs/DocumentSummary?index=16220
D14 D16 D17 = UBXH11-0000057: DIODE LED SMT YELLOW CLEAR LENS 2.1V 10MA 0603 YELLOW; Manufacturer: Lite-on Technology Corporation; Manufacturer P/N: LTST-C190YKT; Editor: eric.moog; Env: GREEN; Permitted Use: Volume Products; Mfg P/N Status: Active; Mfg P/N Split: 100; Mfg P/N Released: No; Color: *; Part Number: UBXH11-0000057; Value: YELLOW; Size: 0603; Min Operating Temp: -55°C; Max Operating Temp: 85°C; Part Type: LED; UBX Wiki: https://wiki.u-blox.com/bin/view/Operations/PartDetails?index=38120; Perferred: N/A; RefDes: DS; Mfg P/N Datasheet: https://wiki.u-blox.com/bin/view/Generic/Docs/DocumentSummary?index=38122
D20 = 1N4148WTQ-7: Diode; Manufacturer_Name: Diodes Incorporated; Datasheet Link: https://datasheet.datasheetarchive.com/originals/distributors/Datasheets_SAMA/6cd1b04b95e93ddd69dba57393c402aa.pdf; Height: 0.65mm; Manufacturer_Part_Number: 1N4148WTQ-7; Mouser Part Number: 621-1N4148WTQ-7; Mouser Price/Stock: https://www.mouser.co.uk/ProductDetail/Diodes-Incorporated/1N4148WTQ-7?qs=vdQOMtKMWaCrKb90MkA6xQ%3D%3D; Arrow Part Number: 1N4148WTQ-7; Arrow Price/Stock: https://www.arrow.com/en/products/1n4148wtq-7/diodes-incorporated?region=europe
J15 J16 = M20-8762042: Connector; Manufacturer_Name: Amphenol; Height: 10.01mm; Manufacturer_Part_Number: 95157-440LF
  J16: Mouser Price/Stock: https://www.mouser.co.uk/ProductDetail/Harwin/M20-8762042?qs=vF78I%252BjhbY%2F5WnwPzhFszw%3D%3D
J17-J20 = 130-00102: Socket Strip 0.1" 8 Pin 1Row SMD Black; Manufacturer 1: Samtec; Manufacturer Part Number 1: SSM-108-F-SV-P-TR; Part Name: CON SKT Strip 0.1" 8Pin 1Row SMD Black; Item Phase: In Production; Use in new designs: Yes; Voltage: 572VDC; UBX Code: None; Part Number: 130-00102; Supplier 1: Avnet; Supplier Part Number 1: SSM-108-F-SV-P-TR; Diameter: None; Height: 7.37mm; Max Operating Temp: 105; Min Operating Temp: -55; Pins: 8; Revision: 0D; Manufacturer 2: Sullins Connector Solutions; Manufacturer Part Number 2: NPPC081KFXC-RC; Supplier 2: Digi-Key; Supplier Part Number 2: S5639-ND
R27 R123 R135 R136 R138 R140 R141 R143 R146 R147 = UBXH18-0003002: as R57 on sheet EVK-NORA-W4_SCHEM_0004_Debug_Memory; Part Number: UBXH18-0003002; Max Power: 100mW; Part Type: Resistor; Release Data: 2012-06-05 09:49:55.978616; UBX Wiki: https://wiki.u-blox.com/bin/view/Operations/PartDetails?index=6611; RefDes: R; Manufacturer 2: YAGEO; Manufacturer P/N 2: 2322_705_91001_L; Mfg P/N Status 2: NRND; Mfg P/N Split 2: 0; Mfg P/N Released 2: Yes
  R136 R138 R141: Value: 0R; Size: 0402
R121 R122 R124 R129 R132 R134 R139 = UBXH18-0008041: RES THICK FILM CHIP 0402 470R 5% 100mW; Manufacturer: ROHM; Manufacturer P/N: MCR01MZPJ471; Editor: roland.rust; Env: ROHS; Permitted Use: Volume Products; Perferred: PREF; Mfg P/N Status: Obsolete; Mfg P/N Split: 100; Mfg P/N Released: Yes; Part Number: UBXH18-0008041; Tolerance: 5%; Max Power: 100mW; Part Type: Resistor; Released by: roland.rust; Release Data: 2009-04-24T14:36:39; UBX Wiki: https://wiki.u-blox.com/bin/view/Operations/PartDetails?index=6926; RefDes: R; Manufacturer 2: KOA; Manufacturer P/N 2: RK73B1ETTP471J; Mfg P/N Status 2: Active; Mfg P/N Split 2: 0; Mfg P/N Released 2: Yes; Manufacturer 3: YAGEO; Manufacturer P/N 3: 2322_705_87471_L; Mfg P/N Status 3: Obsolete; Mfg P/N Split 3: 0; Mfg P/N Released 3: Yes
R137 = UBXH18-0008046: RES THICK FILM CHIP 0402 750R 5% 100mW; Manufacturer: Panasonic; Manufacturer P/N: ERJ2GEJ751X; Editor: jaka.bevk; Released by: erian.bezhani; Env: ROHS; Permitted Use: Volume Products; Perferred: PREF; Mfg P/N Status: Active; Mfg P/N Split: 100; Mfg P/N Released: Yes; Part Number: UBXH18-0008046; Tolerance: 5%; Max Power: 100mW; Part Type: Resistor; Release Data: 2014-10-03T09:31:33; UBX Wiki: https://wiki.u-blox.com/bin/view/Operations/PartDetails?index=6935; RefDes: R; Mfg P/N Datasheet: https://wiki.u-blox.com/bin/view/Generic/Docs/DocumentSummary?index=21267
R142 = UBXH18-0000216: RES THICK FILM CHIP 0402 360R 1% 63mW; Manufacturer: KOA; Manufacturer P/N: RK73H1ETTP3600F; Editor: michael.hein; Released by: vasyl.dykyy; Env: ROHS; Permitted Use: Volume Products; Perferred: PREF; Mfg P/N Status: Active; Mfg P/N Split: 100; Mfg P/N Released: Yes; Part Number: UBXH18-0000216; Tolerance: 1%; Max Power: 63mW; Part Type: Resistor; Release Data: 2015-10-02T11:55:45; Automotive: Yes; UBX Wiki: https://wiki.u-blox.com/bin/view/Operations/PartDetails?index=23306; RefDes: R; Mfg P/N Datasheet: https://wiki.u-blox.com/bin/view/Generic/Docs/DocumentSummary?index=8222
R144 = UBXH18-0008033: RES THICK FILM CHIP 0402 220R 5% 63mW; Manufacturer: KOA; Manufacturer P/N: RK73B1ETTP221J; Editor: alvaro.nussbaum; Released by: martin.pilik; Env: ROHS; Permitted Use: Volume Products; Perferred: PREF; Mfg P/N Status: Active; Mfg P/N Split: 100; Mfg P/N Released: Yes; Part Number: UBXH18-0008033; Tolerance: 5%; Max Power: 63mW; Part Type: Resistor; Release Data: 2024-02-26T15:01:33; UBX Wiki: https://wiki.u-blox.com/bin/view/Operations/PartDetails?index=6914; RefDes: R; Manufacturer 2: YAGEO; Manufacturer P/N 2: RC0402JR-13220RL; Mfg P/N Status 2: Active; Mfg P/N Split 2: 0; Mfg P/N Released 2: Yes; Manufacturer 3: ROHM; Manufacturer P/N 3: MCR01MZPJ221; Mfg P/N Status 3: Obsolete; Mfg P/N Split 3: 0; Mfg P/N Released 3: Yes; Mfg P/N Datasheet: https://wiki.u-blox.com/bin/view/Generic/Docs/DocumentSummary?index=39896; Mfg P/N Datasheet 2: https://wiki.u-blox.com/bin/view/Generic/Docs/DocumentSummary?index=26941
R145 = UBXH18-0000065: RES THICK FILM CHIP 0402 10K 1% 63mW; Manufacturer: KOA; Manufacturer P/N: RK73H1ETTP1002F; Editor: erian.bezhani; Released by: massimo.vlacci; Env: ROHS; Permitted Use: Volume Products; Perferred: PREF; Mfg P/N Status: Active; Mfg P/N Split: 100; Mfg P/N Released: Yes; Part Number: UBXH18-0000065; Tolerance: 1%; Max Power: 63mW; Part Type: Resistor; Release Data: 2012-06-08 18:02:21.521517; UBX Wiki: https://wiki.u-blox.com/bin/view/Operations/PartDetails?index=16837; RefDes: R; Mfg P/N Datasheet: https://wiki.u-blox.com/bin/view/Generic/Docs/DocumentSummary?index=8222
RGB1 = 115-00026: LED RGB SMT 0606; Manufacturer 1: Lite-On Inc; Manufacturer Part Number 1: LTST-C19HE1WT; Body Size: 1.6mm x 1.6mm; Current: 20mA; Item Phase: In Production; MFG Package: 0606; Use in new designs: Yes; Voltage: None; Color: *; Part Number: 115-00026; Supplier 1: Digi-Key; Supplier Part Number 1: 160-2162-1-ND; Height: 0.35mm; Max Operating Temp: 80; Min Operating Temp: -20; Part Name: LED RGB SMT 0606; Pins: 4; Revision: 0B; Size: Other; UBX Code: None; Supplier 2: Digi-Key; Supplier Part Number 2: 1516-1184-1-ND
RGB2 = 4684: LED; Manufacturer_Name: Adafruit; Datasheet Link: https://cdn-shop.adafruit.com/product-files/4684/4684_WS2812B-2020_V1.3_EN.pdf; Height: 0.84mm; Manufacturer_Part_Number: 4684; Mouser Part Number: 485-4684; Mouser Price/Stock: https://www.mouser.co.uk/ProductDetail/Adafruit/4684?qs=DPoM0jnrROWIv9%2FMCIm5vw%3D%3D; Arrow Part Number: 4684; Arrow Price/Stock: https://www.arrow.com/en/products/4684/adafruit-industries?region=nac
TP45-TP124 = TP10R: as TP10-TP25 on sheet EVK-NORA-W4_SCHEM_0004_Debug_Memory; Part Number: TP10R; Size: 1.0mm; Height: 0; DNP: DNP; Checked By: Paul B
  TP45-TP56 TP58-TP124: Added Date: 2/1/2015; Checked Date: 2/5/2015
  TP57: Added Date: 2015-02-01; Checked Date: 2015-02-05
U11-U13 = 74LVC3G07DP,125: Integrated Circuit; Manufacturer_Name: Nexperia; Datasheet Link: https://assets.nexperia.com/documents/data-sheet/74LVC3G07.pdf; Height: 1.1mm; Manufacturer_Part_Number: 74LVC3G07DP,125; Mouser Part Number: 771-74LVC3G07DP-G; Mouser Price/Stock: https://www.mouser.co.uk/ProductDetail/Nexperia/74LVC3G07DP125?qs=me8TqzrmIYXM25jpSFl3Hg%3D%3D; Arrow Part Number: 74LVC3G07DP,125; Arrow Price/Stock: https://www.arrow.com/en/products/74lvc3g07dp125/nexperia?region=nac